# Altium project MX.PrjPcb
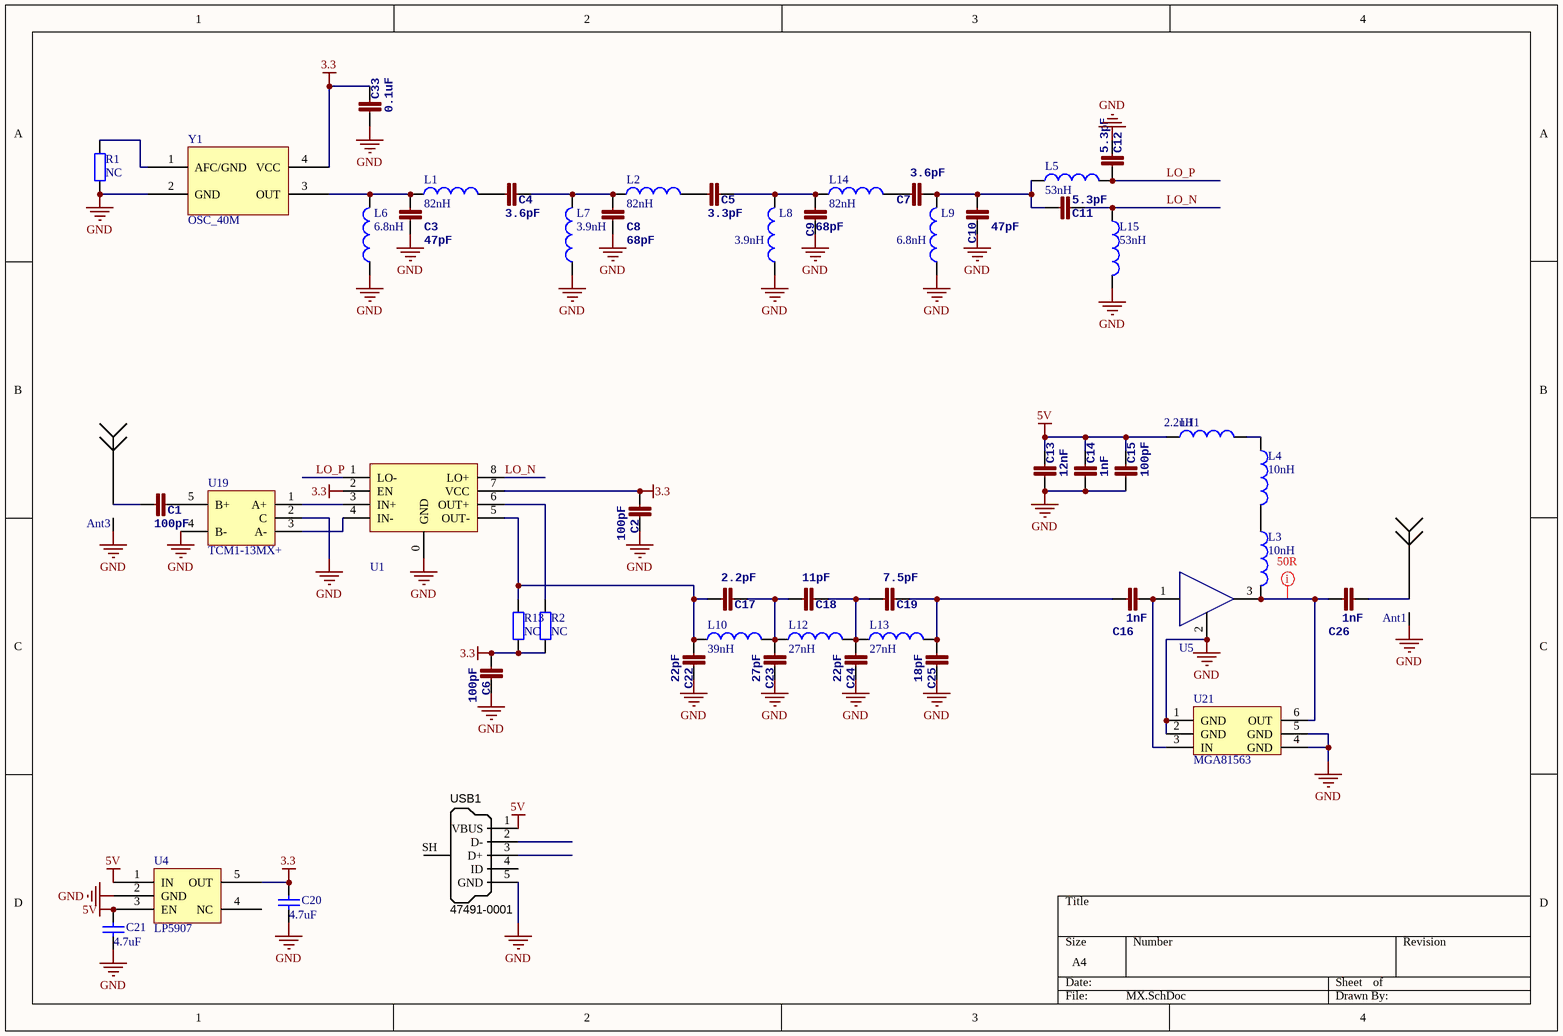
[diagram p0: MX.SchDoc]
1 sheet, 54 parts. Net scope: global (net labels, ports and power ports of the same name join across sheets).
Board file: MX.PcbDoc

## Sheet MX.SchDoc
size A4

### Parts
Ant1  Antenna  [SMA]  (value not drawn)
Ant3  Antenna  [SMA]  (value not drawn)
C1  100pF  [0402]
C2  100pF  [0402]
C3  47pF  [0402]
C4  3.6pF  [0402]
C5  3.3pF  [0402]
C6  100pF  [0402]
C7  3.6pF  [0402]
C8  68pF  [0402]
C9  68pF  [0402]
C10  47pF  [0402]
C11  5.3pF  [0402]
C12  5.3pF  [0402]
C13  12nF  [0805]
C14  1nF  [0402]
C15  100pF  [0402]
C16  1nF  [0402]
C17  2.2pF  [0402]
C18  11pF  [0402]
C19  7.5pF  [0402]
C20  4.7uF  [0603L]
C21  4.7uF  [0603L]
C22  22pF  [0402]
C23  27pF  [0402]
C24  22pF  [0402]
C25  18pF  [0402]
C26  1nF  [0402]
C33  0.1uF  [0402]
L1  value 82nH  [0402]  (hidden comment: Inductor)
L2  value 82nH  [0402]  (hidden comment: Inductor)
L3  value 10nH  [0402]  (hidden comment: Inductor)
L4  value 10nH  [0603]  (hidden comment: Inductor)
L5  value 53nH  [0402]  (hidden comment: Inductor)
L6  value 6.8nH  [0402]  (hidden comment: Inductor)
L7  value 3.9nH  [0402]  (hidden comment: Inductor)
L8  value 3.9nH  [0402]  (hidden comment: Inductor)
L9  value 6.8nH  [0402]  (hidden comment: Inductor)
L10  value 39nH  [0402]  (hidden comment: Inductor)
L11  2.2uH  [L4015]
L12  value 27nH  [0402]  (hidden comment: Inductor)
L13  value 27nH  [0402]  (hidden comment: Inductor)
L14  value 82nH  [0402]  (hidden comment: Inductor)
L15  value 53nH  [0402]  (hidden comment: Inductor)
R1  NC  [0402]
R2  NC  [0402]
R13  NC  [0402]
U1  LT5560  [LT5560]  (value not drawn)
U4  LP5907  [SOT23-5]
U5  AMP-SOT89  [SOT-89]  (value not drawn)
U19  TCM1-13MX+  [TCM-13M+]
U21  MGA81563  [SC-70-6]
USB1  Manufacturer Part Number 1: 47491-0001  [MICRO-YZX]  (hidden comment: USB Micro Type B)
Y1  OSC_40M  [TXC_7Q]

### Nets
3.3: C2.1 C6.1 C20.2 C33.2 R2.2 R13.2 U1.2(EN) U1.7(VCC) U4.5(OUT) Y1.4(VCC)
5V: C13.2 C14.2 C15.2 C21.2 L11.1 U4.1(IN) U4.3(EN) USB1.1(VBUS)
GND: Ant1.GND(G) Ant3.GND(G) C2.2 C3.2 C6.2 C8.2 C9.2 C10.2 C12.2 C13.1 C14.1 C15.1 C20.1 C21.1 C22.2 C23.2 C24.2 C25.2 C33.1 L6.1 L7.1 L8.1 L9.1 L15.2 R1.2 U1.0(GND) U4.2(GND) U5.2 U19.2(C) U19.4(B-) U21.1(GND) U21.2(GND) U21.4(GND) U21.5(GND) USB1.5(GND) Y1.2(GND)
LO_N: C11.2 L15.1 U1.8(LO+)
LO_P: C12.1 L5.2 U1.1(LO-)
NetAnt1_1: Ant1.1 C26.2
NetAnt3_1: Ant3.1 C1.1
NetC1_2: C1.2 U19.5(B+)
NetC3_1: C3.1 L1.1 L6.2 Y1.3(OUT)
NetC4_1: C4.1 L1.2
NetC4_2: C4.2 C8.1 L2.1 L7.2
NetC5_1: C5.1 L2.2
NetC5_2: C5.2 C9.1 L8.2 L14.1
NetC7_1: C7.1 L14.2
NetC7_2: C7.2 C10.1 C11.1 L5.1 L9.2
NetC16_1: C16.1 C19.2 C25.1 L13.2
NetC16_2: C16.2 U5.1 U21.3(IN)
NetC17_1: C17.1 C22.1 L10.1 R13.1 U1.5(OUT-)
NetC17_2: C17.2 C18.1 C23.1 L10.2 L12.1
NetC18_2: C18.2 C19.1 C24.1 L12.2 L13.1
NetC26_1: C26.1 L3.2 U5.3 U21.6(OUT)
NetL3_1: L3.1 L4.2
NetL4_1: L4.1 L11.2
NetR1_1: R1.1 Y1.1(AFC/GND)
NetR2_1: R2.1 U1.6(OUT+)
NetU1_3: U1.3(IN+) U19.1(A+)
NetU1_4: U1.4(IN-) U19.3(A-)

Not connected (* = marked no-connect by the designer): U4 4(NC); USB1 2(D-) 3(D+) 4(ID) SH(Shell)

### Layout directives
net class 50R: NetC26_1

### Library data of the parts
C1-C19 C22-C26 C33 = CAP0402-CAP: <b>Capacitor</b> / Standard 0603 ceramic capacitor, and 0.1" leaded capacitor.; PARTNO: CC0402ZRY5V7BB104
C20 C21 = Cap: Capacitor; Published: 8-Jun-2000; LatestRevisionDate: 17-Jul-2002; LatestRevisionNote: Re-released for DXP Platform.; PackageReference: RAD-0.3; Publisher: Altium Limited; PackageDescription: Radial Cap, Thru-Hole; 2 Leads; 0.3 in Pin Spacing
L1-L15 = Inductor: Code_IEC: 1005; Published: 8-Jun-2000; LatestRevisionDate: 29-May-2009; LatestRevisionNote: IPC-7351 Footprint Added.; PackageReference: 0402-A; Publisher: Altium Limited; PackageDescription: Chip Inductor; Code_JEITA: 0402
R1 R2 R13 = Res2: Resistor; Published: 8-Jun-2000; LatestRevisionDate: 17-Jul-2002; LatestRevisionNote: Re-released for DXP Platform.; PackageReference: AXIAL-0.4; Publisher: Altium Limited; PackageDescription: Axial Device, Thru-Hole; 2 Leads; 0.4 in Pin Spacing
U19 = TCM-63AX+
USB1 = USB_Micro_TypeB: Connector SMD USB Micro Type B middle mount; Manufacturer 1: Molex Inc; SCDType: undef; Package / Case: SMD; Supplier 1: Digi-Key; Supplier Part Number 1: WM17142CT-ND